# EAGLE design ergodox (EAGLE 5.12)
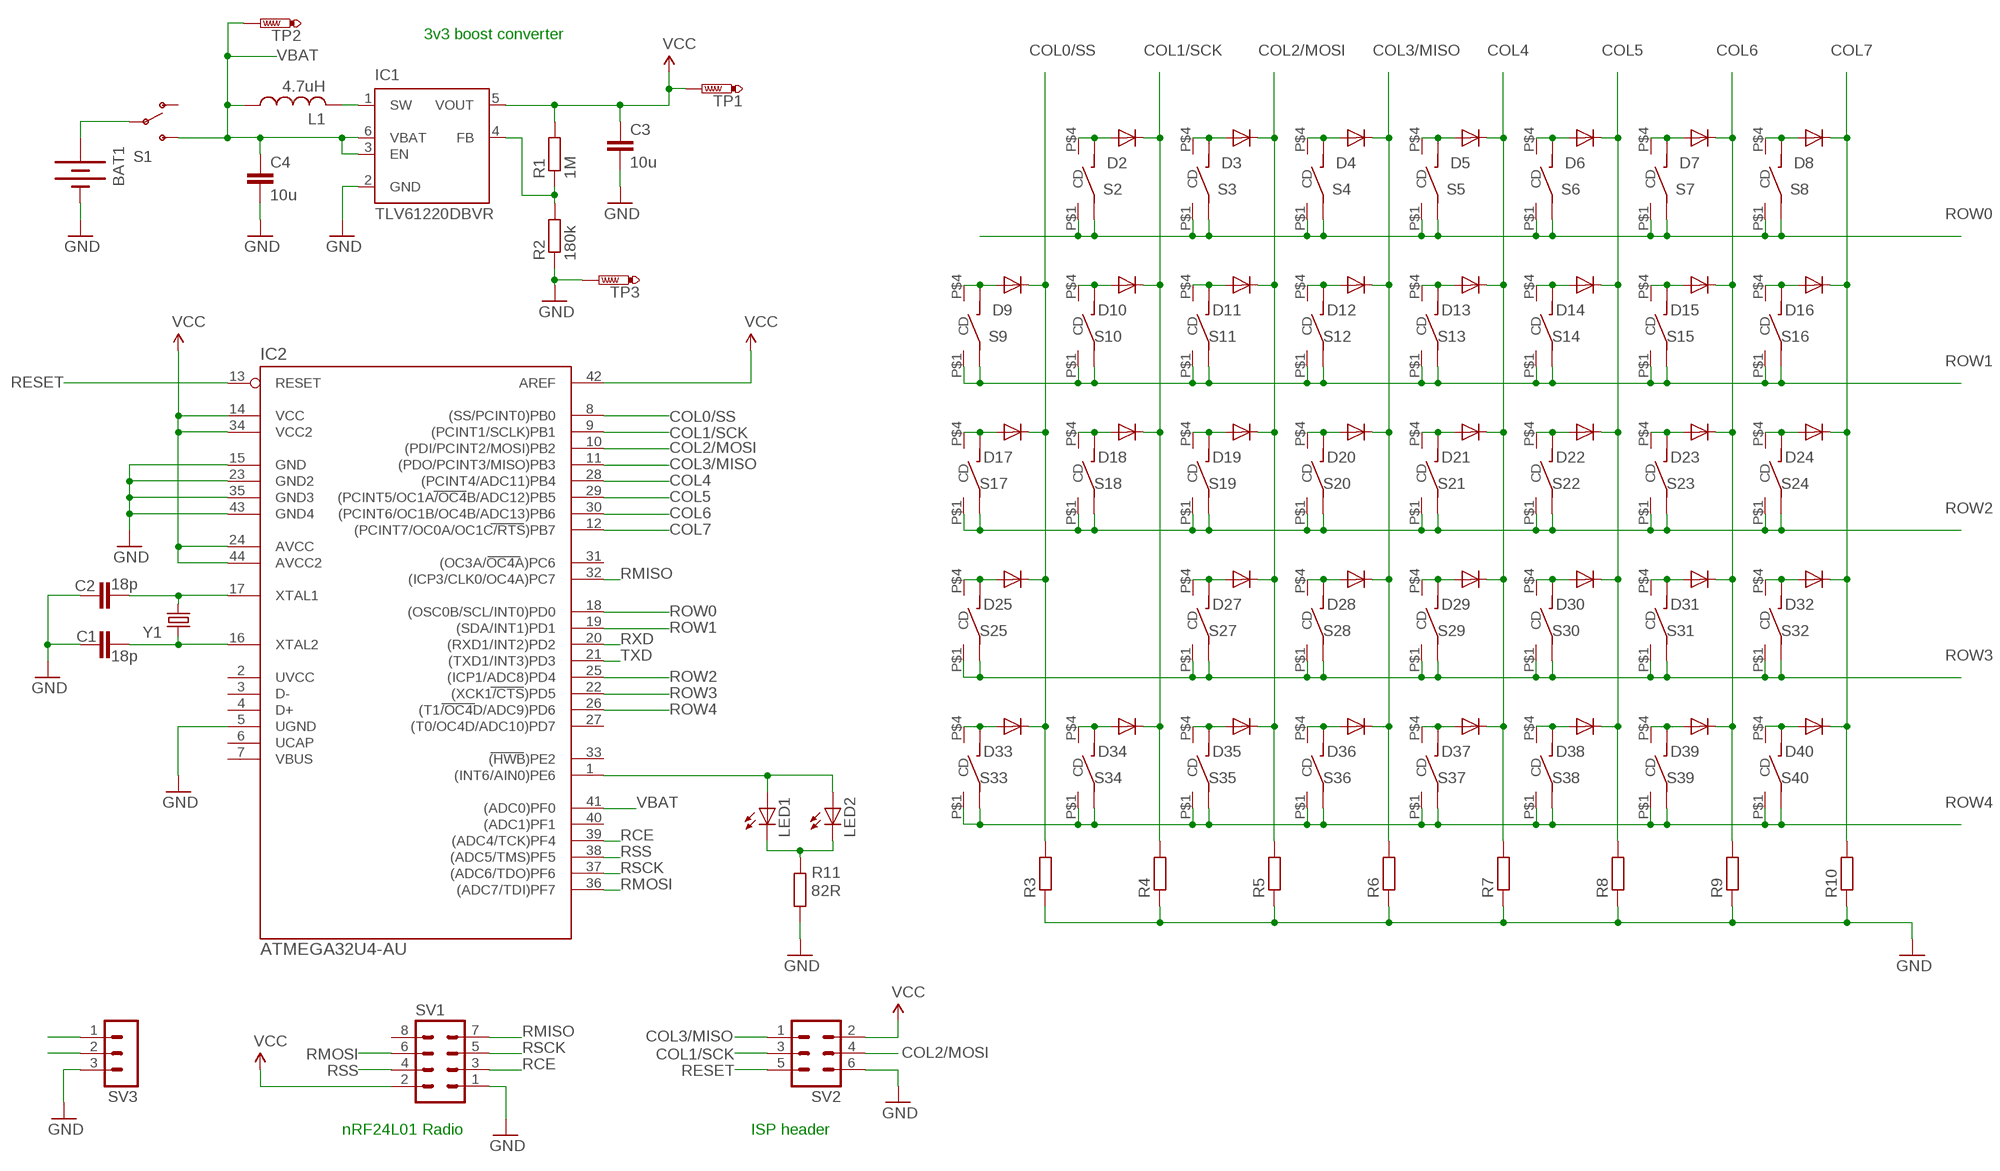
[diagram p0: schematic, sheet 1]

## Parts
BAT1  BATTERYAA  [BATTERY-AA]
C1  18p  CAP0805  [0805]
C2  18p  CAP0805  [0805]
C3  10u  CAP0805  [0805]
C4  10u  CAP0805  [0805]
D2  1N4148DO35-7  [DO35-7]
D3  1N4148DO35-7  [DO35-7]
D4  1N4148DO35-7  [DO35-7]
D5  1N4148DO35-7  [DO35-7]
D6  1N4148DO35-7  [DO35-7]
D7  1N4148DO35-7  [DO35-7]
D8  1N4148DO35-7  [DO35-7]
D9  1N4148DO35-7  [DO35-7]
D10  1N4148DO35-7  [DO35-7]
D11  1N4148DO35-7  [DO35-7]
D12  1N4148DO35-7  [DO35-7]
D13  1N4148DO35-7  [DO35-7]
D14  1N4148DO35-7  [DO35-7]
D15  1N4148DO35-7  [DO35-7]
D16  1N4148DO35-7  [DO35-7]
D17  1N4148DO35-7  [DO35-7]
D18  1N4148DO35-7  [DO35-7]
D19  1N4148DO35-7  [DO35-7]
D20  1N4148DO35-7  [DO35-7]
D21  1N4148DO35-7  [DO35-7]
D22  1N4148DO35-7  [DO35-7]
D23  1N4148DO35-7  [DO35-7]
D24  1N4148DO35-7  [DO35-7]
D25  1N4148DO35-7  [DO35-7]
D27  1N4148DO35-7  [DO35-7]
D28  1N4148DO35-7  [DO35-7]
D29  1N4148DO35-7  [DO35-7]
D30  1N4148DO35-7  [DO35-7]
D31  1N4148DO35-7  [DO35-7]
D32  1N4148DO35-7  [DO35-7]
D33  1N4148DO35-7  [DO35-7]
D34  1N4148DO35-7  [DO35-7]
D35  1N4148DO35-7  [DO35-7]
D36  1N4148DO35-7  [DO35-7]
D37  1N4148DO35-7  [DO35-7]
D38  1N4148DO35-7  [DO35-7]
D39  1N4148DO35-7  [DO35-7]
D40  1N4148DO35-7  [DO35-7]
IC1  TLV61220DBVR  TPS61070DDC  [TSOT23-6_DDC]
IC2  ATMEGA32U4-AU  [TQFP44]
L1  4.7uH  L-USL3230M  [L3230M]
LED1  LED1206  [LED-1206]
LED2  LED1206  [LED-1206]
R1  1M  R-EU_R0805  [R0805]
R2  180k  R-EU_R0805  [R0805]
R3  R-EU_R0805  [R0805]
R4  R-EU_R0805  [R0805]
R5  R-EU_R0805  [R0805]
R6  R-EU_R0805  [R0805]
R7  R-EU_R0805  [R0805]
R8  R-EU_R0805  [R0805]
R9  R-EU_R0805  [R0805]
R10  R-EU_R0805  [R0805]
R11  82R  R-EU_R0805  [R0805]
S1  SWITCH-SPSTSMD2  [SWITCH-SPDT-SMD]
S2  CHERRYMX  [CHERRYMX]
S3  CHERRYMX  [CHERRYMX]
S4  CHERRYMX  [CHERRYMX]
S5  CHERRYMX  [CHERRYMX]
S6  CHERRYMX  [CHERRYMX]
S7  CHERRYMX  [CHERRYMX]
S8  CHERRYMX  [CHERRYMX]
S9  CHERRYMX  [CHERRYMX]
S10  CHERRYMX  [CHERRYMX]
S11  CHERRYMX  [CHERRYMX]
S12  CHERRYMX  [CHERRYMX]
S13  CHERRYMX  [CHERRYMX]
S14  CHERRYMX  [CHERRYMX]
S15  CHERRYMX  [CHERRYMX]
S16  CHERRYMX  [CHERRYMX]
S17  CHERRYMX  [CHERRYMX]
S18  CHERRYMX  [CHERRYMX]
S19  CHERRYMX  [CHERRYMX]
S20  CHERRYMX  [CHERRYMX]
S21  CHERRYMX  [CHERRYMX]
S22  CHERRYMX  [CHERRYMX]
S23  CHERRYMX  [CHERRYMX]
S24  CHERRYMX  [CHERRYMX]
S25  CHERRYMX  [CHERRYMX]
S27  CHERRYMX  [CHERRYMX]
S28  CHERRYMX  [CHERRYMX]
S29  CHERRYMX  [CHERRYMX]
S30  CHERRYMX  [CHERRYMX]
S31  CHERRYMX  [CHERRYMX]
S32  CHERRYMX  [CHERRYMX]
S33  CHERRYMX  [CHERRYMX]
S34  CHERRYMX  [CHERRYMX]
S35  CHERRYMX  [CHERRYMX]
S36  CHERRYMX  [CHERRYMX]
S37  CHERRYMX  [CHERRYMX]
S38  CHERRYMX  [CHERRYMX]
S39  CHERRYMX  [CHERRYMX]
S40  CHERRYMX  [CHERRYMX]
SV1  MA04-2  [MA04-2]
SV2  MA03-2  [MA03-2]
SV3  MA03-1  [MA03-1]
TP1  PTR1TP15R  [TP15R]
TP2  PTR1TP15R  [TP15R]
TP3  PTR1TP15R  [TP15R]
Y1  CRYSTAL10.5X4.8  [CRYSTAL-SMD-10.5X4.8-2PIN]

## Nets
COL0/SS: D9.C D17.C D25.C D33.C IC2.8((SS/PCINT0)PB0) R3.2
COL1/SCK: D2.C D10.C D18.C D34.C IC2.9((PCINT1/SCLK)PB1) R4.2 SV2.3
COL2/MOSI: D3.C D11.C D19.C D27.C D35.C IC2.10((PDI/PCINT2/MOSI)PB2) R5.2 SV2.4
COL3/MISO: D4.C D12.C D20.C D28.C D36.C IC2.11((PDO/PCINT3/MISO)PB3) R6.2 SV2.1
COL4: D5.C D13.C D21.C D29.C D37.C IC2.28((PCINT4/ADC11)PB4) R7.2
COL5: D6.C D14.C D22.C D30.C D38.C IC2.29((PCINT5/OC1A/OC4B/ADC12)PB5) R8.2
COL6: D7.C D15.C D23.C D31.C D39.C IC2.30((PCINT6/OC1B/OC4B/ADC13)PB6) R9.2
COL7: D8.C D16.C D24.C D32.C D40.C IC2.12((PCINT7/OC0A/OC1C/RTS)PB7) R10.2
GND: BAT1.GND@1(-) C1.1 C2.1 C3.2 C4.2 IC1.2(GND) IC2.5(UGND) IC2.15(GND) IC2.23(GND2) IC2.35(GND3) IC2.43(GND4) R2.1 R3.1 R4.1 R5.1 R6.1 R7.1 R8.1 R9.1 R10.1 R11.1 SV1.1 SV2.6 SV3.3 TP3.TP
N$1: C2.2 IC2.17(XTAL1) Y1.P$2
N$2: D2.A S2.P$3(B) S2.P$4(D)
N$3: D3.A S3.P$3(B) S3.P$4(D)
N$4: D4.A S4.P$3(B) S4.P$4(D)
N$5: D5.A S5.P$3(B) S5.P$4(D)
N$6: D6.A S6.P$3(B) S6.P$4(D)
N$7: D7.A S7.P$3(B) S7.P$4(D)
N$8: D8.A S8.P$3(B) S8.P$4(D)
N$9: C1.2 IC2.16(XTAL2) Y1.P$1
N$10: IC1.1(SW) L1.2
N$11: IC1.4(FB) R1.1 R2.2
N$12: LED1.C LED2.C R11.2
N$13: BAT1.PWR@1(+) S1.2(P)
N$15: IC2.1((INT6/AIN0)PE6) LED1.A LED2.A
N$18: D9.A S9.P$3(B) S9.P$4(D)
N$19: D10.A S10.P$3(B) S10.P$4(D)
N$20: D11.A S11.P$3(B) S11.P$4(D)
N$21: D12.A S12.P$3(B) S12.P$4(D)
N$22: D13.A S13.P$3(B) S13.P$4(D)
N$23: D14.A S14.P$3(B) S14.P$4(D)
N$24: D15.A S15.P$3(B) S15.P$4(D)
N$25: D16.A S16.P$3(B) S16.P$4(D)
N$35: D17.A S17.P$3(B) S17.P$4(D)
N$36: D18.A S18.P$3(B) S18.P$4(D)
N$37: D19.A S19.P$3(B) S19.P$4(D)
N$38: D20.A S20.P$3(B) S20.P$4(D)
N$39: D21.A S21.P$3(B) S21.P$4(D)
N$40: D22.A S22.P$3(B) S22.P$4(D)
N$41: D23.A S23.P$3(B) S23.P$4(D)
N$42: D24.A S24.P$3(B) S24.P$4(D)
N$52: D25.A S25.P$3(B) S25.P$4(D)
N$54: D27.A S27.P$3(B) S27.P$4(D)
N$55: D28.A S28.P$3(B) S28.P$4(D)
N$56: D29.A S29.P$3(B) S29.P$4(D)
N$57: D30.A S30.P$3(B) S30.P$4(D)
N$58: D31.A S31.P$3(B) S31.P$4(D)
N$59: D32.A S32.P$3(B) S32.P$4(D)
N$69: D33.A S33.P$3(B) S33.P$4(D)
N$70: D34.A S34.P$3(B) S34.P$4(D)
N$71: D35.A S35.P$3(B) S35.P$4(D)
N$72: D36.A S36.P$3(B) S36.P$4(D)
N$73: D37.A S37.P$3(B) S37.P$4(D)
N$74: D38.A S38.P$3(B) S38.P$4(D)
N$75: D39.A S39.P$3(B) S39.P$4(D)
N$76: D40.A S40.P$3(B) S40.P$4(D)
RCE: IC2.39((ADC4/TCK)PF4) SV1.3
RESET: IC2.13(RESET) SV2.5
RMISO: IC2.32((ICP3/CLK0/OC4A)PC7) SV1.7
RMOSI: IC2.36((ADC7/TDI)PF7) SV1.6
ROW0: IC2.18((OSC0B/SCL/INT0)PD0) S2.P$1(C) S2.P$2(A) S3.P$1(C) S3.P$2(A) S4.P$1(C) S4.P$2(A) S5.P$1(C) S5.P$2(A) S6.P$1(C) S6.P$2(A) S7.P$1(C) S7.P$2(A) S8.P$1(C) S8.P$2(A)
ROW1: IC2.19((SDA/INT1)PD1) S9.P$1(C) S9.P$2(A) S10.P$1(C) S10.P$2(A) S11.P$1(C) S11.P$2(A) S12.P$1(C) S12.P$2(A) S13.P$1(C) S13.P$2(A) S14.P$1(C) S14.P$2(A) S15.P$1(C) S15.P$2(A) S16.P$1(C) S16.P$2(A)
ROW2: IC2.25((ICP1/ADC8)PD4) S17.P$1(C) S17.P$2(A) S18.P$1(C) S18.P$2(A) S19.P$1(C) S19.P$2(A) S20.P$1(C) S20.P$2(A) S21.P$1(C) S21.P$2(A) S22.P$1(C) S22.P$2(A) S23.P$1(C) S23.P$2(A) S24.P$1(C) S24.P$2(A)
ROW3: IC2.22((XCK1/CTS)PD5) S25.P$1(C) S25.P$2(A) S27.P$1(C) S27.P$2(A) S28.P$1(C) S28.P$2(A) S29.P$1(C) S29.P$2(A) S30.P$1(C) S30.P$2(A) S31.P$1(C) S31.P$2(A) S32.P$1(C) S32.P$2(A)
ROW4: IC2.26((T1/OC4D/ADC9)PD6) S33.P$1(C) S33.P$2(A) S34.P$1(C) S34.P$2(A) S35.P$1(C) S35.P$2(A) S36.P$1(C) S36.P$2(A) S37.P$1(C) S37.P$2(A) S38.P$1(C) S38.P$2(A) S39.P$1(C) S39.P$2(A) S40.P$1(C) S40.P$2(A)
RSCK: IC2.37((ADC6/TDO)PF6) SV1.5
RSS: IC2.38((ADC5/TMS)PF5) SV1.4
RXD: IC2.20((RXD1/INT2)PD2) SV3.2
TXD: IC2.21((TXD1/INT3)PD3) SV3.1
VBAT: C4.1 IC1.3(EN) IC1.6(VBAT) IC2.41((ADC0)PF0) L1.1 S1.3(S) TP2.TP
VCC: C3.1 IC1.5(VOUT) IC2.14(VCC) IC2.24(AVCC) IC2.34(VCC2) IC2.42(AREF) IC2.44(AVCC2) R1.2 SV1.2 SV2.2 TP1.TP
Unconnected: IC2.2(UVCC) IC2.3(D-) IC2.4(D+) IC2.6(UCAP) IC2.7(VBUS) IC2.27((T0/OC4D/ADC10)PD7) IC2.31((OC3A/OC4A)PC6) IC2.33((HWB)PE2) IC2.40((ADC1)PF1) S1.1(O) SV1.8

## Notes on the sheet
- 3v3 boost converter
- nRF24L01 Radio | ISP header

## Library data of the parts
BAT1 = SparkFun:BATTERY: Battery Holders Various common sizes : AA, AAA, 20mm coin cell and 12mm coin cell.
C1-C4 = SparkFun:CAP: Capacitor Standard 0603 ceramic capacitor, and 0.1" leaded capacitor.
D2-D25 D27-D40 = diode:1N4148: DIODE high speed (Philips)
IC1 = texas:TPS6107*: 90% EFFICIENT SYNCHRONOUS BOOST CONVERTER WITH 600-mA SWITCH Source: http://focus.ti.com/lit/ds/symlink/tps61070.pdf; MPN: TPS61070DDCR; OC_FARNELL: 1461062; OC_NEWARK: 64M3125
IC2 = mega32U4:ATMEGA32U4-AU
L1 = resistor:L-US: INDUCTOR, American symbol
LED1 LED2 = SparkFun:LED: LEDs Standard schematic elements and footprints for 5mm, 3mm, 1206, and 0603 sized LEDs. 5mm - Spark Fun Electronics SKU : COM-00529 (and others)
R1-R11 = resistor:R-EU_: RESISTOR, European symbol
S1 = SparkFun:SWITCH-SPST: SPST Switch Simple slide switch. Spark Fun Electronics SKU : COM-00102
S2-S25 S27-S40 = cherrymx:CHERRYMX: PUSH SWITCH www.radiohm.com
SV1 = con-lstb:MA04-2: PIN HEADER; OC_FARNELL: unknown; OC_NEWARK: unknown
SV2 = con-lstb:MA03-2: PIN HEADER; OC_FARNELL: unknown; OC_NEWARK: unknown
SV3 = con-lstb:MA03-1: PIN HEADER; OC_FARNELL: unknown; OC_NEWARK: unknown
TP1-TP3 = testpad:PTR1: TEST PIN
Y1 = SparkFun:CRYSTAL: Crystals Various standard crystals. Proven footprints. Spark Fun Electronics SKU : COM-00534

## Board
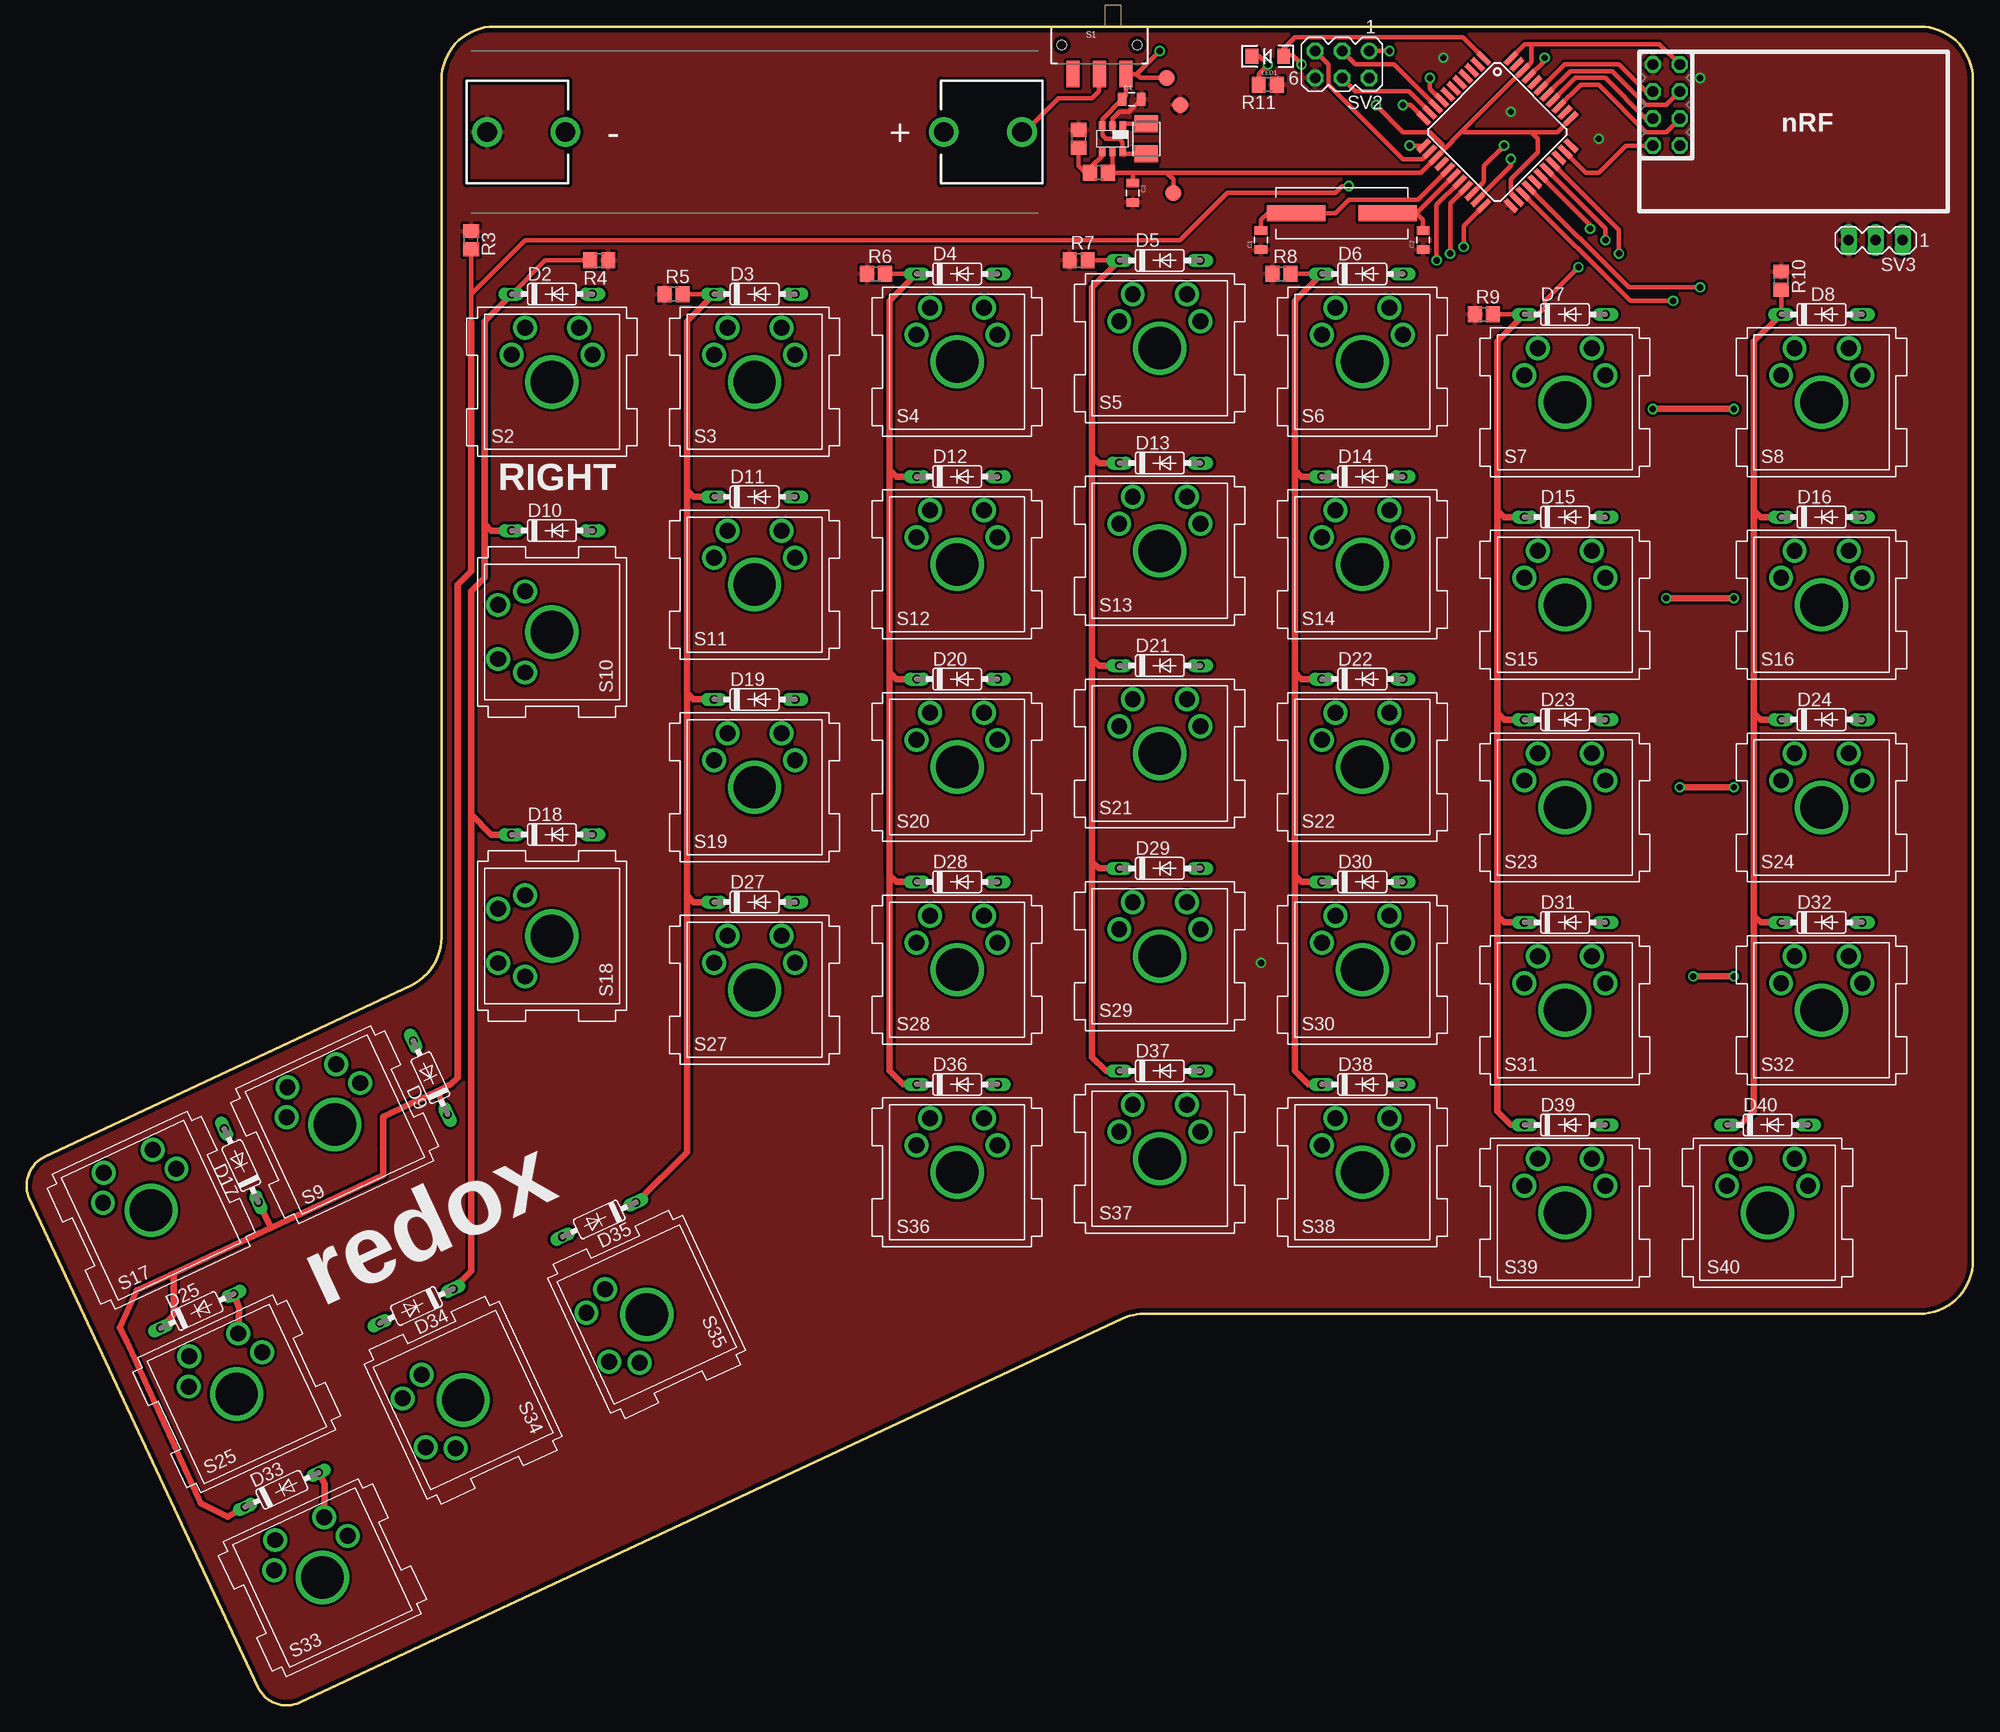
[diagram p1: board, top side]
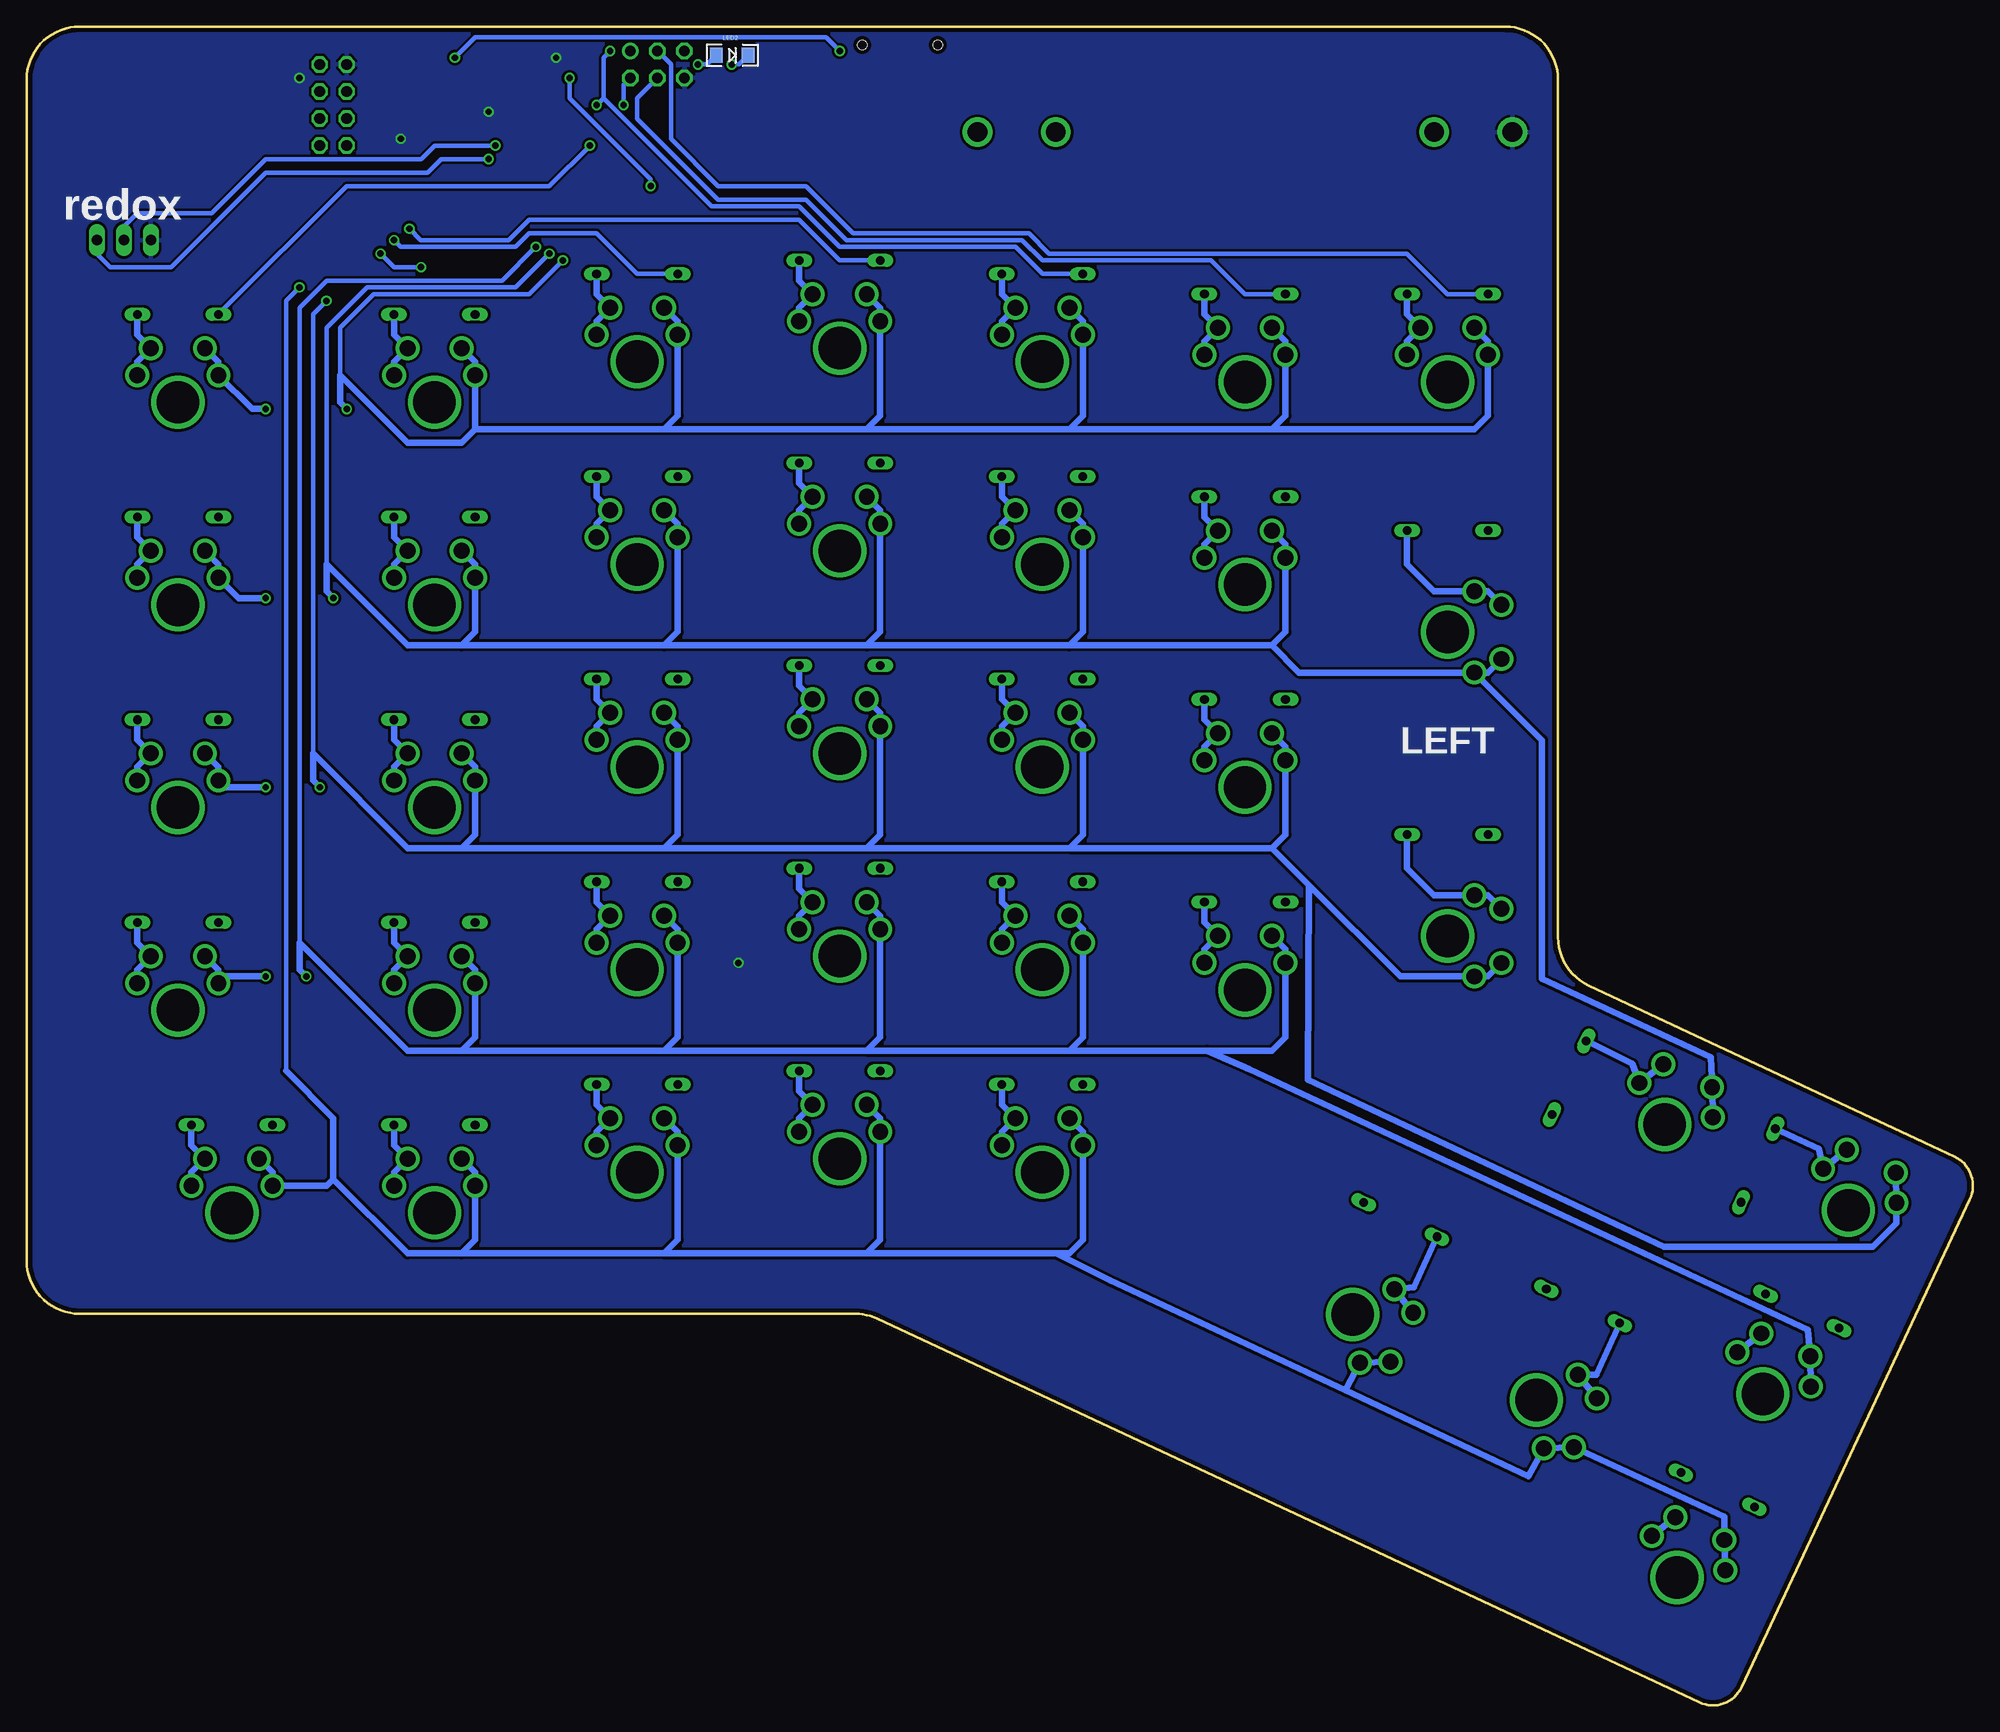
[diagram p2: board, bottom side, seen from below]

Size 183.01 x 157.81 mm. Coordinates in mm from the lower left corner, seen from the top.
Outline: 44.01,157.81 arc90 39.01,152.81 39.01,72.19 arc-65 36.13,67.66 1.73,51.58 arc90 0.28,47.59 21.74,1.73 arc90 25.73,0.28 103.01,36.34 arc-25 105.12,36.81 178.01,36.81 arc90 183.01,41.81 183.01,152.81 arc90 178.01,157.81 44.01,157.81
Copper layers (1*16): Top 0.0356mm / dielectric 1.5011mm / Bottom 0.0356mm
Design rules "LaenPCBOrder": minimum track width 6mil, minimum drill 13mil, track to track 6mil, track to pad 6mil, pad to pad 6mil, via to via 6mil, smd to smd 6mil, copper to edge 15mil, drill to drill 6mil, minimum pad ring 7mil, minimum via ring 7mil, stop-mask expansion 3mil, vias tented up to drill 0mil, thermal gap 10mil

### Footprints (pad centres in the part's own frame; a part is rotated, then mirrored left to right if it is on the bottom)
BATTERY-AA = drill 1.854 round: GND@1 25.146,0; GND@2 17.78,0; PWR@1 -25.146,0; PWR@2 -17.78,0
0805 = smd 0.8 x 1.2: 1 -0.9,0; 2 0.9,0
DO35-7 = drill 0.813 long: A 3.81,0; C -3.81,0
TSOT23-6_DDC = smd 0.6 x 0.8: 1 -0.95,-1.25; 2 0,-1.25; 3 0.95,-1.25; 4 0.95,1.25; 5 0,1.25; 6 -0.95,1.25
TQFP44 = smd 1.5 x 0.5: 1 -5.8,4; 2 -5.8,3.2; 3 -5.8,2.4; 4 -5.8,1.6; 5 -5.8,0.8; 6 -5.8,0; 7 -5.8,-0.8; 8 -5.8,-1.6; 9 -5.8,-2.4; 10 -5.8,-3.2; 11 -5.8,-4; 23 5.8,-4; 24 5.8,-3.2; 25 5.8,-2.4; 26 5.8,-1.6; 27 5.8,-0.8; 28 5.8,0; 29 5.8,0.8; 30 5.8,1.6; 31 5.8,2.4; 32 5.8,3.2; 33 5.8,4 | smd 0.5 x 1.5: 12 -4,-5.8; 13 -3.2,-5.8; 14 -2.4,-5.8; 15 -1.6,-5.8; 16 -0.8,-5.8; 17 0,-5.8; 18 0.8,-5.8; 19 1.6,-5.8; 20 2.4,-5.8; 21 3.2,-5.8; 22 4,-5.8; 34 4,5.8; 35 3.2,5.8; 36 2.4,5.8; 37 1.6,5.8; 38 0.8,5.8; 39 0,5.8; 40 -0.8,5.8; 41 -1.6,5.8; 42 -2.4,5.8; 43 -3.2,5.8; 44 -4,5.8
L3230M = smd 1.6 x 2.2: 1 -1.4,0; 2 1.4,0
LED-1206 = smd 1.2 x 1.4: A -1.5,0; C 1.5,0
R0805 = smd 1.3 x 1.5: 1 -0.85,0; 2 0.85,0
SWITCH-SPDT-SMD = smd 1.2 x 2.5: 1 -2.5,-2.75; 2 0,-2.75; 3 2.5,-2.75 | hole 0.9: -3.55,0; 3.55,0
CHERRYMX = drill 1.499 round: P$1 -3.81,2.54; P$2 -2.54,5.08; P$3 2.54,5.08; P$4 3.81,2.54 | drill 3.988 round: P$5 0,0
MA04-2 = drill 1.016 octagon: 1 -3.81,-1.27; 2 -3.81,1.27; 3 -1.27,-1.27; 4 -1.27,1.27; 5 1.27,-1.27; 6 1.27,1.27; 7 3.81,-1.27; 8 3.81,1.27
MA03-2 = drill 1.016 round: 1 -2.54,-1.27 | drill 1.016 octagon: 2 -2.54,1.27; 3 0,-1.27; 4 0,1.27; 5 2.54,-1.27; 6 2.54,1.27
MA03-1 = drill 1.016 long: 1 -2.54,0; 2 0,0; 3 2.54,0
TP15R = smd 1.5 x 1.5: TP 0,0
CRYSTAL-SMD-10.5X4.8-2PIN = smd 5.5 x 1.5: P$1 -4.3,0; P$2 4.3,0

### Placement (x,y rotation side)
BAT1  68.45,147.9 180 top
C1  116.08,137.74 90 top
C2  131.32,137.74 90 top
C3  104.01,142.19 270 top
C4  103.92,150.98 0 top
D2  49.4,132.66 0 top
D3  68.45,132.66 0 top
D4  87.5,134.57 0 top
D5  106.55,135.84 0 top
D6  125.6,134.57 0 top
D7  144.65,130.76 0 top
D8  168.78,130.76 0 top
D9  37.97,59 115 top
D10  49.4,110.44 0 top
D11  68.45,113.61 0 top
D12  87.5,115.52 0 top
D13  106.55,116.79 0 top
D14  125.6,115.52 0 top
D15  144.65,111.71 0 top
D16  168.78,111.71 0 top
D17  20.19,50.75 115 top
D18  49.4,81.86 0 top
D19  68.45,94.56 0 top
D20  87.5,96.47 0 top
D21  106.55,97.74 0 top
D22  125.6,96.47 0 top
D23  144.65,92.66 0 top
D24  168.78,92.66 0 top
D25  16.04,37.07 25 top
D27  68.45,75.51 0 top
D28  87.5,77.42 0 top
D29  106.55,78.69 0 top
D30  125.6,77.42 0 top
D31  144.65,73.61 0 top
D32  168.78,73.61 0 top
D33  24,20.27 25 top
D34  36.66,37.54 205 top
D35  53.85,45.67 205 top
D36  87.5,58.37 0 top
D37  106.55,59.64 0 top
D38  125.6,58.37 0 top
D39  144.65,54.56 0 top
D40  163.7,54.56 0 top
IC1  102.11,147.27 180 top
IC2  138.3,147.9 315 top
L1  105.28,147.27 90 top
LED1  116.71,155.02 180 top
LED2  116.67,155.11 0 bottom
R1  100.84,144.09 0 top
R2  98.93,147.27 270 top
R3  41.78,137.74 270 top
R4  53.85,135.84 180 top
R5  60.83,132.66 0 top
R6  79.88,134.57 0 top
R7  98.93,135.84 0 top
R8  117.98,134.57 0 top
R9  137.03,130.76 0 top
R10  164.97,133.93 270 top
R11  116.71,152.35 180 top
S1  100.88,156.09 0 top
S2  49.4,124.41 0 top
S3  68.45,124.41 0 top
S4  87.5,126.31 0 top
S5  106.55,127.58 0 top
S6  125.6,126.31 0 top
S7  144.65,122.5 0 top
S8  168.78,122.5 0 top
S9  28.97,54.59 25 top
S10  49.4,100.9 90 top
S11  68.45,105.36 0 top
S12  87.5,107.26 0 top
S13  106.55,108.53 0 top
S14  125.6,107.26 0 top
S15  144.65,103.45 0 top
S16  168.78,103.45 0 top
S17  11.71,46.54 25 top
S18  49.4,72.33 90 top
S19  68.45,86.31 0 top
S20  87.5,88.21 0 top
S21  106.55,89.48 0 top
S22  125.6,88.21 0 top
S23  144.65,84.4 0 top
S24  168.78,84.4 0 top
S25  19.76,29.28 25 top
S27  68.45,67.26 0 top
S28  87.5,69.16 0 top
S29  106.55,70.43 0 top
S30  125.6,69.16 0 top
S31  144.65,65.35 0 top
S32  168.78,65.35 0 top
S33  27.81,12.01 25 top
S34  41.05,28.69 115 top
S35  58.31,36.75 115 top
S36  87.5,50.11 0 top
S37  106.55,51.38 0 top
S38  125.6,50.11 0 top
S39  144.65,46.3 0 top
S40  163.7,46.3 0 top
SV1  154.18,150.44 270 top
SV2  123.7,154.25 180 top
SV3  173.86,137.74 180 top
TP1  107.82,142.19 0 top
TP2  107.19,152.98 0 top
TP3  108.46,150.44 0 top
Y1  123.7,140.28 0 top

### Tracks (layer width: path | path; a pad name or v marks a point on that pad's centre or on a via)
COL0/SS  (via drill 0.6)
  Top 0.406: 41.78,130.12 41.78,132.66 | 41.78,132.66 R3.2 | IC2.8 131.95,151.99 v131.95,152.98 | 41.78,132.66 46.86,137.74 108.46,137.74 112.9,142.19 123.06,142.19 123.7,142.82 v124.33,142.82
  Top 0.61: 38.61,57.73 D9.C | D33.C 18.92,17.73 16.38,19 9.4,34.24 8.76,35.51 10.35,39 13.46,40.42 | 13.46,40.42 13.84,40.59 13.84,36.71 D25.C | 38.61,57.73 39.88,58.37 40.51,59 40.51,105.36 41.78,106.63 41.78,130.12 | 38.61,57.73 33.51,55.31 33.53,52.65 33.53,50.11 33.51,49.81 22.98,44.88 | 22.98,44.88 13.46,40.42 | 22.98,44.88 D17.C
  Bottom 0.406: v131.95,152.98 131.95,151.08 124.33,143.46 v124.33,142.82
COL1/SCK
  Top 0.406: SV2.3 124.97,154.25 128.56,154.25 IC2.9 | R4.2 48.77,135.84 D2.C
  Top 0.61: D2.C 43.05,130.12 43.05,111.07 | 43.05,111.07 43.05,105.99 41.78,104.72 41.78,83.77 | 41.78,83.77 41.78,40.82 D34.C | D10.C 43.69,110.44 43.05,111.07 | D18.C 43.69,81.86 41.78,83.77
  Bottom 0.406: D2.C 49.4,132.66 53.21,136.47 86.87,136.47 88.77,138.38 105.28,138.38 109.73,142.82 117.98,142.82 122.43,147.27 122.43,154.25 SV2.3
COL2/MOSI
  Top 0.406: SV2.4 124.97,151.71 129.96,151.71 IC2.10 | D3.C R5.2
  Top 0.61: D3.C 62.1,130.12 62.1,114.25 | 62.1,95.2 62.1,114.25 | 62.1,95.2 62.1,76.15 | 62.1,76.15 62.1,52.02 57.36,47.28 D35.C | D11.C 62.74,113.61 62.1,114.25 | D19.C 62.74,94.56 62.1,95.2 | D27.C 62.74,75.51 62.1,76.15
  Bottom 0.406: D3.C 68.45,132.66 71.63,135.84 87.5,135.84 89.41,137.74 105.92,137.74 109.73,141.55 117.98,141.55 125.6,149.17 125.6,151.08 SV2.4
COL3/MISO  (via drill 0.6)
  Top 0.406: v128.14,155.52 SV2.1 | v129.41,150.44 130.1,150.44 IC2.11 | D4.C R6.2
  Top 0.61: D4.C 81.15,132.03 81.15,116.15 | 81.15,78.05 81.15,59.64 82.42,58.37 D36.C | 81.15,78.05 81.15,97.1 | 81.15,97.1 81.15,116.15 | D28.C 81.79,77.42 81.15,78.05 | D20.C 81.79,96.47 81.15,97.1 | D12.C 81.79,115.52 81.15,116.15
  Bottom 0.406: D4.C 87.5,134.57 90.04,137.11 106.55,137.11 110.36,140.92 118.62,140.92 128.78,151.08 | v128.14,155.52 128.78,154.89 128.78,151.08 | 128.78,151.08 v129.41,150.44
COL4  (via drill 0.6)
  Top 0.406: D5.C R7.2 | v147.01,138.81 147.01,139.19 IC2.28
  Top 0.61: D5.C 100.2,133.3 100.2,117.42 | 100.2,79.32 100.2,60.91 101.47,59.64 D37.C | 100.2,79.32 100.2,98.37 | 100.2,98.37 100.2,117.42 | D29.C 100.84,78.69 100.2,79.32 | D21.C 100.84,97.74 100.2,98.37 | D13.C 100.84,116.79 100.2,117.42
  Bottom 0.406: D5.C 106.55,135.84 110.36,139.65 135.76,139.65 137.67,137.74 145.94,137.74 v147.01,138.81
COL5  (via drill 0.6)
  Top 0.406: D6.C R8.2 | v148.46,137.74 148.46,138.87 IC2.29
  Top 0.61: D6.C 119.25,132.03 119.25,116.15 | 119.25,78.05 119.25,59.64 120.52,58.37 D38.C | 119.25,78.05 119.25,97.1 | 119.25,97.1 119.25,116.15 | D30.C 119.89,77.42 119.25,78.05 | D22.C 119.89,96.47 119.25,97.1 | D14.C 119.89,115.52 119.25,116.15
  Bottom 0.406: D6.C 125.6,134.57 129.41,138.38 135.76,138.38 137.03,137.11 147.83,137.11 v148.46,137.74
COL6  (via drill 0.6)
  Top 0.406: R9.2 D7.C 142.11,130.76 142.75,131.39 142.75,132.03 v145.92,135.2 | v149.73,136.47 149.73,138.73 IC2.30
  Top 0.61: D7.C 138.3,128.22 138.3,112.34 | 138.3,74.24 138.3,55.83 139.57,54.56 D39.C | 138.3,74.24 138.3,93.29 | 138.3,93.29 138.3,112.34 | D31.C 138.94,73.61 138.3,74.24 | D23.C 138.94,92.66 138.3,93.29 | D15.C 138.94,111.71 138.3,112.34
  Bottom 0.406: v145.92,135.2 148.46,135.2 v149.73,136.47
COL7  (via drill 0.6)
  Top 0.406: IC2.12 v130.05,146.63 | D8.C R10.2
  Top 0.61: D8.C 162.43,128.22 162.43,112.34 | 162.43,74.24 162.43,55.83 161.16,54.56 D40.C | 162.43,74.24 162.43,93.29 | 162.43,93.29 162.43,112.34 | D32.C 163.07,73.61 162.43,74.24 | D24.C 163.07,92.66 162.43,93.29 | D16.C 163.07,111.71 162.43,112.34
  Bottom 0.406: v130.05,146.63 133.86,142.82 152.91,142.82 D8.C
GND  (via drill 0.6)
  Top 0.406: IC1.2 102.11,149.17 102.74,149.81 103.64,149.81 C4.2
  other vias: 157.35,152.98 139.57,149.81 147.83,147.27 133.22,154.89 116.08,69.8
  pour Top (isolate 0.254): 35.43,160.6 187.2,160.6 187.2,17.73 72.9,17.73 72.9,-3.86 -4.57,-3.86 -4.57,72.97 35.43,72.97
  pour Bottom (isolate 0.254): 33.53,163.14 185.29,163.14 185.29,20.27 70.99,20.27 70.99,-1.32 -6.48,-1.32 -6.48,75.51 33.53,75.51
N$1
  Top 0.406: IC2.17 | 130.68,140.28 IC2.17 | 130.68,140.28 Y1.P$2 | C2.2 131.32,139.65 130.68,140.28
N$2
  Bottom 0.61: S2.P$4 53.21,128.22 S2.P$3 53.21,130.76 D2.A
N$3
  Bottom 0.61: S3.P$4 72.26,128.22 S3.P$3 72.26,130.76 D3.A
N$4
  Bottom 0.61: S4.P$4 91.31,130.12 S4.P$3 91.31,132.66 D4.A
N$5
  Bottom 0.61: S5.P$4 110.36,131.39 S5.P$3 110.36,133.93 D5.A
N$6
  Bottom 0.61: S6.P$4 129.41,130.12 S6.P$3 129.41,132.66 D6.A
N$7
  Bottom 0.61: S7.P$4 148.46,126.31 S7.P$3 148.46,128.85 D7.A
N$8
  Bottom 0.61: S8.P$4 172.59,126.31 S8.P$3 172.59,128.85 D8.A
N$9
  Top 0.406: C1.2 116.08,139.65 116.71,140.28 Y1.P$1 123.06,140.28 124.33,141.55 130.82,141.55 IC2.16
N$10
  Top 0.406: L1.2 103.21,148.67 IC1.1
N$11
  Top 0.406: R2.2 98.93,144.73 99.57,144.09 R1.1 100.2,144.31 100.2,144.73 101.16,145.68 IC1.4
N$12  (via drill 0.6)
  Top 0.406: LED1.C 115.94,155.02 v116.71,154.25 115.86,153.4 R11.2
  Bottom 0.406: v116.71,154.25 116.03,154.25 LED2.C
N$13
  Top 0.406: BAT1.PWR@1 93.85,147.9 97.03,151.08 100.2,151.08 100.84,151.71 100.84,153.29 S1.2
N$15  (via drill 0.6)
  Top 0.406: IC2.1 135.07,156.79 119.25,156.79 118.17,155.71 LED2.A | LED2.A 119.03,155.11 v119.89,154.25 | LED2.A 118.17,155.07 LED1.A
  Bottom 0.406: v119.89,154.25 119.03,154.25 LED2.A
N$18
  Bottom 0.61: S9.P$3 S9.P$4 32.01,60.31 D9.A
N$19
  Bottom 0.61: S10.P$3 45.59,104.71 S10.P$4 50.66,104.71 53.21,107.26 D10.A
N$20
  Bottom 0.61: S11.P$4 72.26,109.17 S11.P$3 72.26,111.71 D11.A
N$21
  Bottom 0.61: D12.A 91.31,113.61 S12.P$3 91.31,111.07 S12.P$4
N$22
  Bottom 0.61: S13.P$4 110.36,112.34 S13.P$3 110.36,114.88 D13.A
N$23
  Bottom 0.61: S14.P$4 129.41,111.07 S14.P$3 129.41,113.61 D14.A
N$24
  Bottom 0.61: S15.P$4 148.46,107.26 S15.P$3 148.46,109.8 D15.A
N$25
  Bottom 0.61: D16.A 172.59,109.8 S16.P$3 172.59,107.26 S16.P$4
N$35
  Bottom 0.61: S17.P$3 S17.P$4 14.51,52.31 D17.A
N$36
  Bottom 0.61: S18.P$3 45.59,76.14 S18.P$4 50.66,76.14 53.21,78.69 D18.A
N$37
  Bottom 0.61: S19.P$4 72.26,90.12 S19.P$3 72.26,92.66 D19.A
N$38
  Bottom 0.61: S20.P$4 91.31,92.02 S20.P$3 91.31,94.56 D20.A
N$39
  Bottom 0.61: S21.P$4 110.36,93.29 S21.P$3 110.36,95.83 D21.A
N$40
  Bottom 0.61: S22.P$4 129.41,92.02 S22.P$3 129.41,94.56 D22.A
N$41
  Bottom 0.61: S23.P$4 148.46,88.21 S23.P$3 148.46,90.75 D23.A
N$42
  Bottom 0.61: S24.P$4 172.59,88.21 S24.P$3 172.59,90.75 D24.A
N$52
  Top 0.61: S25.P$3 20.01,37.31 D25.A
  Bottom 0.61: S25.P$3 S25.P$4
N$54
  Bottom 0.61: S27.P$4 72.26,71.07 S27.P$3 72.26,73.61 D27.A
N$55
  Bottom 0.61: S28.P$4 91.31,72.97 S28.P$3 91.31,75.51 D28.A
N$56
  Bottom 0.61: S29.P$4 110.36,74.24 S29.P$3 110.36,76.78 D29.A
N$57
  Bottom 0.61: S30.P$4 129.41,72.97 S30.P$3 129.41,75.51 D30.A
N$58
  Bottom 0.61: S31.P$4 148.46,69.16 S31.P$3 148.46,71.7 D31.A
N$59
  Bottom 0.61: S32.P$4 172.59,69.16 S32.P$3 172.59,71.7 D32.A
N$69
  Top 0.61: S33.P$3 28.01,20.81 D33.A
  Bottom 0.61: S33.P$3 S33.P$4
N$70
  Bottom 0.61: S34.P$3 S34.P$4 35.43,31.06 D34.A
N$71
  Bottom 0.61: S35.P$3 S35.P$4 52.58,39.32 D35.A
N$72
  Bottom 0.61: D36.A 91.31,56.46 S36.P$3 91.31,53.92 S36.P$4
N$73
  Bottom 0.61: D37.A 110.36,57.73 S37.P$3 110.36,55.19 S37.P$4
N$74
  Bottom 0.61: S38.P$4 129.41,53.92 S38.P$3 129.41,56.46 D38.A
N$75
  Bottom 0.61: S39.P$4 148.46,50.11 S39.P$3 148.46,52.65 D39.A
N$76
  Bottom 0.61: S40.P$4 167.51,50.11 S40.P$3 167.51,52.65 D40.A
RCE
  Top 0.406: SV1.3 152.27,151.71 149.73,154.25 144.65,154.25 IC2.39
RESET
  Top 0.406: SV2.5 122.43,154.25 122.43,152.35 129.41,145.36 131.23,145.36 IC2.13
RMISO
  Top 0.406: SV1.7 150.37,146.63 147.83,144.09 146.64,144.09 IC2.32
RMOSI
  Top 0.406: SV1.6 154.18,147.9 152.27,147.9 147.83,152.35 146.14,152.35 IC2.36
ROW0  (via drill 0.6)
  Top 0.406: IC2.18 132.59,141.06 v132.59,135.84
  Top 0.61: v152.91,121.87 v160.53,121.87
  Bottom 0.406: v132.59,135.84 135.76,132.66 150.37,132.66 153.54,129.49 153.54,125.04
  Bottom 0.61: S3.P$2 64.64,128.22 S3.P$1 64.64,121.23 65.91,119.96 | S4.P$2 83.69,130.12 S4.P$1 83.69,121.23 84.96,119.96 | S5.P$2 102.74,131.39 S5.P$1 102.74,121.23 104.01,119.96 | S7.P$2 140.84,126.31 S7.P$1 140.84,119.96 | S6.P$2 121.79,130.12 S6.P$1 121.79,121.23 123.06,119.96 | S8.P$2 164.97,126.31 S8.P$1 161.8,121.87 v160.53,121.87 | 123.06,119.96 140.84,119.96 | 104.01,119.96 123.06,119.96 | 84.96,119.96 104.01,119.96 | 65.91,119.96 84.96,119.96 | 65.91,119.96 46.86,119.96 45.59,121.23 S2.P$1 45.59,128.22 S2.P$2 | 140.84,119.96 142.11,118.69 147.19,118.69 153.54,125.04 153.54,122.5 v152.91,121.87
ROW1  (via drill 0.6)
  Top 0.406: v133.86,136.47 133.86,141.19 IC2.19
  Top 0.61: v154.18,104.09 v160.53,104.09
  Bottom 0.406: 154.81,107.26 154.81,129.49 151,133.3 137.03,133.3 v133.86,136.47
  Bottom 0.61: 142.11,99.64 140.84,100.91 S15.P$1 140.84,107.26 S15.P$2 | 123.06,99.64 142.11,99.64 | 123.06,99.64 121.79,100.91 S14.P$1 121.79,111.07 S14.P$2 | 104.01,99.64 102.74,100.91 S13.P$1 102.74,112.34 S13.P$2 | 104.01,99.64 123.06,99.64 | 84.96,99.64 83.69,100.91 S12.P$1 83.69,111.07 S12.P$2 | 84.96,99.64 104.01,99.64 | 65.91,99.64 64.64,100.91 S11.P$1 64.64,109.17 S11.P$2 | 65.91,99.64 84.96,99.64 | 142.11,99.64 147.19,99.64 154.81,107.26 154.81,104.72 v154.18,104.09 | S9.P$1 S9.P$2 24.64,60.91 40.51,68.31 40.51,90.74 S10.P$1 | S10.P$2 45.59,97.09 S10.P$1 | S10.P$1 63.36,97.09 65.91,99.64 | v160.53,104.09 163.07,104.09 S16.P$1 164.97,107.26 S16.P$2
ROW2  (via drill 0.6)
  Top 0.406: v154.81,132.03 150.78,132.03 IC2.25
  Top 0.61: v155.45,86.31 v160.53,86.31
  Bottom 0.406: 156.08,89.48 156.08,130.76 v154.81,132.03
  Bottom 0.61: 142.11,80.59 147.19,80.59 156.08,89.48 156.08,86.94 v155.45,86.31 | 142.11,80.59 140.84,81.86 S23.P$1 140.84,88.21 S23.P$2 | 123.06,80.59 121.79,81.86 S22.P$1 121.79,92.02 S22.P$2 | 123.06,80.59 142.11,80.59 | 104.01,80.59 102.74,81.86 S21.P$1 102.74,93.29 S21.P$2 | 104.01,80.59 123.06,80.59 | 84.96,80.59 83.69,81.86 S20.P$1 83.69,92.02 S20.P$2 | 84.96,80.59 104.01,80.59 | 65.91,80.59 64.64,81.86 S19.P$1 64.64,90.12 S19.P$2 | 84.96,80.59 65.91,80.59 | S18.P$2 45.59,68.52 S18.P$1 53.84,68.52 62.42,77.1 | 65.91,80.59 62.42,77.1 | 62.42,77.1 62.51,58.81 29.08,43.13 9.4,43.13 7.18,45.34 S17.P$1 S17.P$2 | v160.53,86.31 164.34,86.31 S24.P$1 164.97,88.21 S24.P$2
ROW3  (via drill 0.6)
  Top 0.406: v135.13,137.11 135.13,139.07 IC2.22
  Top 0.61: v156.72,68.53 v160.53,68.53
  Bottom 0.406: 157.35,71.7 157.35,131.39 154.81,133.93 138.3,133.93 v135.13,137.11
  Bottom 0.61: 142.11,61.54 147.19,61.54 157.35,71.7 157.35,69.16 v156.72,68.53 | 142.11,61.54 140.84,62.81 S31.P$1 140.84,69.16 S31.P$2 | 123.06,61.54 121.79,62.81 S30.P$1 121.79,72.97 S30.P$2 | 123.06,61.54 142.11,61.54 | 104.01,61.54 102.74,62.81 S29.P$1 102.74,74.24 S29.P$2 | 104.01,61.54 123.06,61.54 | 84.96,61.54 83.69,62.81 S28.P$1 83.69,72.97 S28.P$2 | 104.01,61.54 84.96,61.54 | 84.96,61.54 72.01,61.54 | 72.01,61.54 65.91,61.54 64.64,62.81 S27.P$1 64.64,71.07 S27.P$2 | S25.P$1 S25.P$2 15.51,35.31 68.01,59.81 72.01,61.54 | v160.53,68.53 164.34,68.53 S32.P$1 164.97,69.16 S32.P$2
ROW4  (via drill 0.6)
  Top 0.406: v157.35,133.3 150.64,133.3 IC2.26
  Bottom 0.406: 158.62,59.64 158.62,132.03 v157.35,133.3
  Bottom 0.61: 158.62,59.64 154.18,55.19 154.18,49.48 | 154.18,49.48 147.19,42.49 142.11,42.49 | 142.11,42.49 140.84,43.76 S39.P$1 140.84,50.11 S39.P$2 | 154.18,49.48 154.81,48.84 S40.P$1 159.89,50.11 S40.P$2 | 123.06,42.49 121.79,43.76 S38.P$1 121.79,53.92 S38.P$2 | 123.06,42.49 142.11,42.49 | 104.01,42.49 102.74,43.76 S37.P$1 102.74,55.19 S37.P$2 | 123.06,42.49 104.01,42.49 | 104.01,42.49 86.23,42.49 | 86.23,42.49 84.96,42.49 83.69,43.76 S36.P$1 83.69,53.92 S36.P$2 | 59.02,29.6 81.15,39.95 86.23,42.49 | 59.02,29.6 41.78,21.54 S34.P$1 S34.P$2 23.37,17.73 S33.P$2 S33.P$1 | 59.02,29.6 S35.P$1 S35.P$2
RSCK
  Top 0.406: SV1.5 152.27,149.17 148.46,152.98 145.64,152.98 IC2.37
RSS
  Top 0.406: SV1.4 154.18,150.44 152.27,150.44 149.1,153.62 145.15,153.62 IC2.38
RXD  (via drill 0.6)
  Top 0.406: IC2.20 137.03,143.24 137.03,144.73 v138.94,146.63
  Bottom 0.406: SV3.2 173.86,139.01 172.59,140.28 165.61,140.28 160.53,145.36 145.92,145.36 144.65,146.63 v138.94,146.63
TXD  (via drill 0.6)
  Top 0.406: IC2.21 136.46,141.62 139.57,144.73 v139.57,145.36
  Bottom 0.406: SV3.1 176.4,136.47 175.13,135.2 169.42,135.2 160.53,144.09 145.29,144.09 144.02,145.36 v139.57,145.36
VBAT  (via drill 0.6)
  Top 0.406: 104.5,146.02 L1.1 103.21,145.87 IC1.6 103.06,146.95 102.74,147.27 101.47,147.27 101.16,147.58 IC1.3 101.16,149.12 C4.1 103.38,151.35 S1.3 104.37,153.34 | IC2.41 142.75,154.61 v142.75,154.89 | 104.37,153.34 v106.55,155.52 | TP2.TP 104.72,152.98 104.37,153.34
  Bottom 0.406: v142.75,154.89 140.84,156.79 107.82,156.79 v106.55,155.52
VCC  (via drill 0.6)
  Top 0.406: R1.2 102.11,144.51 IC1.5 102.11,144.09 104.01,144.09 | 104.01,144.09 107.19,144.09 | 107.19,144.09 131.1,144.09 IC2.14 133.11,146.11 | 133.11,146.11 135.02,148.01 | 135.02,148.01 IC2.42 141.48,154.47 141.48,156.16 | IC2.34 143.96,147.9 141.48,147.9 | SV1.2 153.54,156.16 141.48,156.16 | IC2.44 140.9,156.16 141.48,156.16 | v126.87,150.44 129.41,147.9 131.95,147.9 133.11,146.74 133.11,146.11 | 141.48,147.9 135.13,147.9 135.02,148.01 | 104.01,144.09 C3.1 | IC2.24 139.57,142.11 139.57,143.46 142.11,146 142.11,147.27 141.48,147.9 | TP1.TP 107.82,143.46 107.19,144.09
  Bottom 0.406: SV2.2 126.87,152.35 v126.87,150.44

### Text on the board
tPlace: nRF | RIGHT | redox
bPlace: redox | LEFT
tStop: ksrm